# Altium project Battery BDC Hardware Split P2.PrjPcb
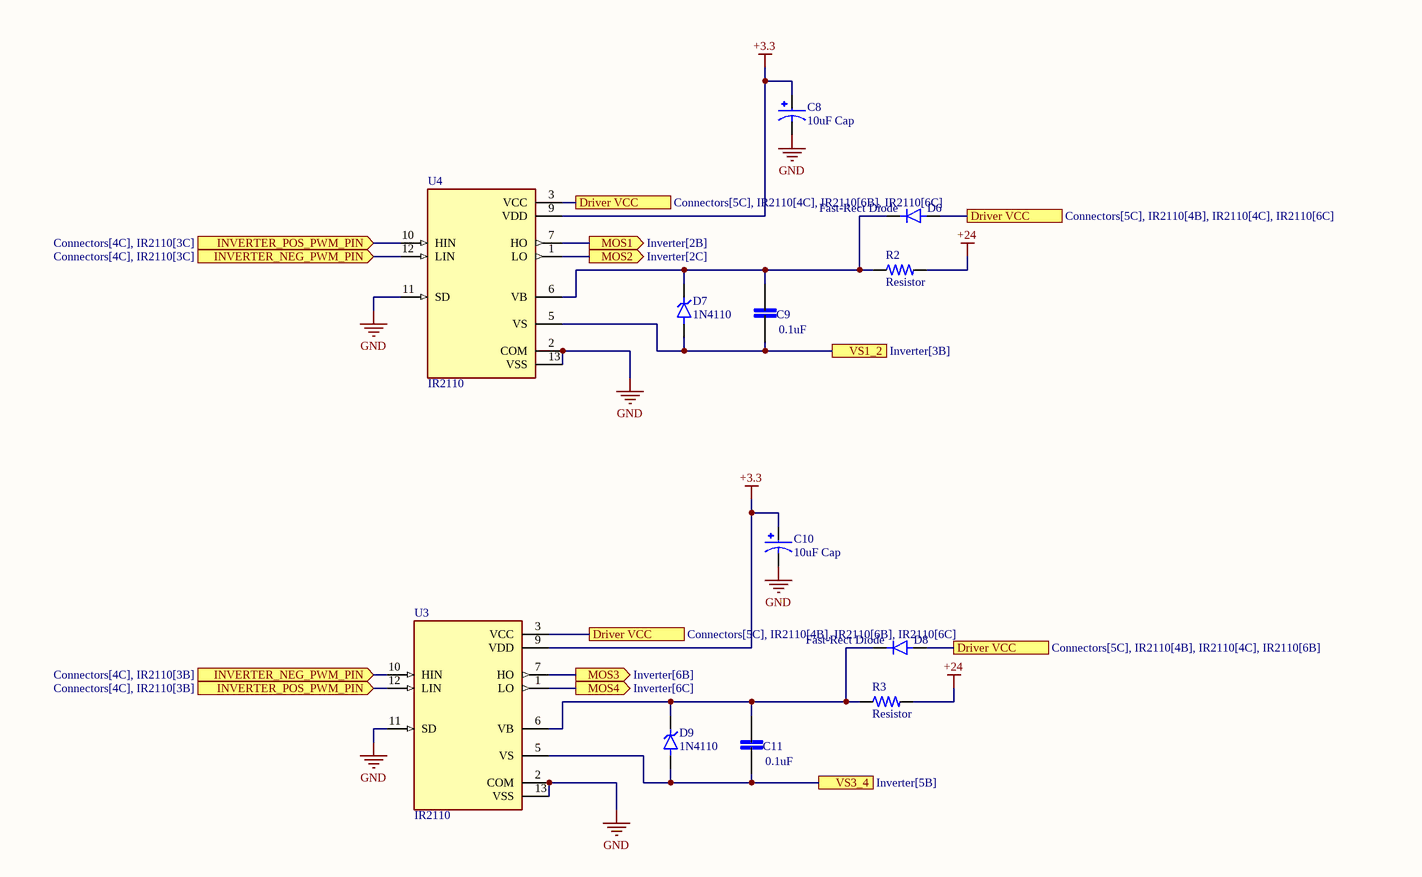
[diagram p0: IR2110.SchDoc]
4 sheets, 71 parts. Net scope: flat (ports and power ports of the same name join across sheets).
Board file: Inverter.PcbDoc
Sheets:
  IR2110.SchDoc
  Inverter.SchDoc
  Power Circuit.SchDoc
  Connectors.SchDoc

## Sheet IR2110.SchDoc
size A3; SheetNumber: 1; SheetTotal: 5

### Parts
C8  10uF Cap  [CAP_10uF]
C9  0.1uF  [Ceramic Capacitor]
C10  10uF Cap  [CAP_10uF]
C11  0.1uF  [Ceramic Capacitor]
D6  Fast-Rect Diode  [Common Trhough Hole]
D7  1N4110  [Common Trhough Hole]
D8  Fast-Rect Diode  [Common Trhough Hole]
D9  1N4110  [Common Trhough Hole]
R2  Resistor  [Resistor_Through Hole]
R3  Resistor  [Resistor_Through Hole]
U3  IR2110  [IR2110]
U4  IR2110  [IR2110]

### Ports
Driver VCC (see Connectors[5C], IR2110[4B], IR2110[4C], IR2110[6B]), Driver VCC (see Connectors[5C], IR2110[4B], IR2110[4C], IR2110[6C]), Driver VCC (see Connectors[5C], IR2110[4B], IR2110[6B], IR2110[6C]), Driver VCC (see Connectors[5C], IR2110[4C], IR2110[6B], IR2110[6C]), INVERTER_NEG_PWM_PIN (in, see Connectors[4C], IR2110[3B]), INVERTER_NEG_PWM_PIN (in, see Connectors[4C], IR2110[3C]), INVERTER_POS_PWM_PIN (in, see Connectors[4C], IR2110[3B]), INVERTER_POS_PWM_PIN (in, see Connectors[4C], IR2110[3C]), MOS1 (out, see Inverter[2B]), MOS2 (out, see Inverter[2C]), MOS3 (out, see Inverter[6B]), MOS4 (out, see Inverter[6C]), VS1_2 (see Inverter[3B]), VS3_4 (see Inverter[5B])

### Nets
+3.3: C8.P C10.P U3.9(VDD) U4.9(VDD)
+24: R2.2 R3.2
GND: C8.N C10.N U3.2(COM) U3.11(SD) U3.13(VSS) U4.2(COM) U4.11(SD) U4.13(VSS)
NetC9_1: C9.1 D7.2(A) U4.5(VS) ; port VS1_2
NetC9_2: C9.2 D6.1(K) D7.1(K) R2.1 U4.6(VB)
NetC11_1: C11.1 D9.2(A) U3.5(VS) ; port VS3_4
NetC11_2: C11.2 D8.1(K) D9.1(K) R3.1 U3.6(VB)
NetD6_2: D6.2(A) D8.2(A) U3.3(VCC) U4.3(VCC) ; port Driver VCC
NetD14_C: U4.7(HO) ; port MOS1
NetD15_C: U3.7(HO) ; port MOS3
NetD17_C: U4.1(LO) ; port MOS2
NetD18_C: U3.1(LO) ; port MOS4
NetJ4_1: U3.12(LIN) U4.10(HIN) ; port INVERTER_POS_PWM_PIN
NetJ4_3: U3.10(HIN) U4.12(LIN) ; port INVERTER_NEG_PWM_PIN

### Library data of the parts
C8 C10 = 10uF Cap: CAP ALUM 10UF 20% 50V RADIAL; MP: ECE-A1HN100UI; MF: Panasonic; SnapEDA_Link: https://www.snapeda.com/parts/ECE-A1HN100UI/Panasonic/view-part/2321690/?ref=snap; Price: None; Check_prices: https://www.snapeda.com/parts/ECE-A1HN100UI/Panasonic/view-part/2321690/?ref=eda; Value: *; Availability: In Stock; Package: RADIAL-2 Panasonic
C9 C11 = Ceramic Capacitor: MP: LD051A121KAB2A; MF: AVX; SnapEDA_Link: https://www.snapeda.com/parts/LD051A121KAB2A/AVX/view-part/?ref=snap; Package: 0805 AVX; Check_prices: https://www.snapeda.com/parts/LD051A121KAB2A/AVX/view-part/?ref=eda; Purchase-URL: https://pricing.snapeda.com/search/part/LD051A121KAB2A/?ref=eda; Price: None; Value: *; Availability: In Stock
D6 D8 = Normal Diode: MF: NTE Electronics, Inc.; MP: 1N4007; Package: DO-41 NTE Electronics; Check_prices: https://www.snapeda.com/parts/1N4007/NTE+Electronics/view-part/?ref=eda; Value: *; Purchase-URL: https://pricing.snapeda.com/search/part/1N4007/?ref=eda; Availability: In Stock; SnapEDA_Link: https://www.snapeda.com/parts/1N4007/NTE+Electronics/view-part/?ref=snap; Price: None
D7 D9 = Zener Diode: MP: 1SMA5926; MF: Taiwan Semiconductor; Package: SMA-2 Taiwan Semiconductor; Availability: In Stock; Purchase-URL: https://pricing.snapeda.com/search/part/1SMA5926/?ref=eda; SnapEDA_Link: https://www.snapeda.com/parts/1SMA5926/Taiwan+Semiconductor/view-part/?ref=snap; Price: None; Check_prices: https://www.snapeda.com/parts/1SMA5926/Taiwan+Semiconductor/view-part/?ref=eda; Value: *
R2 R3 = Resistor: Power_Rating: .25 W; MP: 2-2176053-0; Tolerance: 1%; Resistance: .33; MF: TE Connectivity; Price: None; Availability: In Stock; EU_RoHS_Compliance: Compliant with Exemptions; Package: 0805; Value: *; SnapEDA_Link: https://www.snapeda.com/parts/2-2176053-0/TE+Connectivity/view-part/?ref=snap; Check_prices: https://www.snapeda.com/parts/2-2176053-0/TE+Connectivity/view-part/?ref=eda
U3 U4 = IR2110: Half-Bridge Gate Driver IC Non-Inverting 16-SOIC; MF: Infineon; Package: SOIC-16 International Rectifier; Purchase-URL: https://pricing.snapeda.com/search/part/IR2110/?ref=eda; Value: *; SnapEDA_Link: https://www.snapeda.com/parts/IR2110/Infineon+Technologies/view-part/?ref=snap; Price: None; MP: IR2110; Check_prices: https://www.snapeda.com/parts/IR2110/Infineon+Technologies/view-part/?ref=eda; Availability: In Stock

## Sheet Inverter.SchDoc
size A2; SheetNumber: 2; SheetTotal: 5
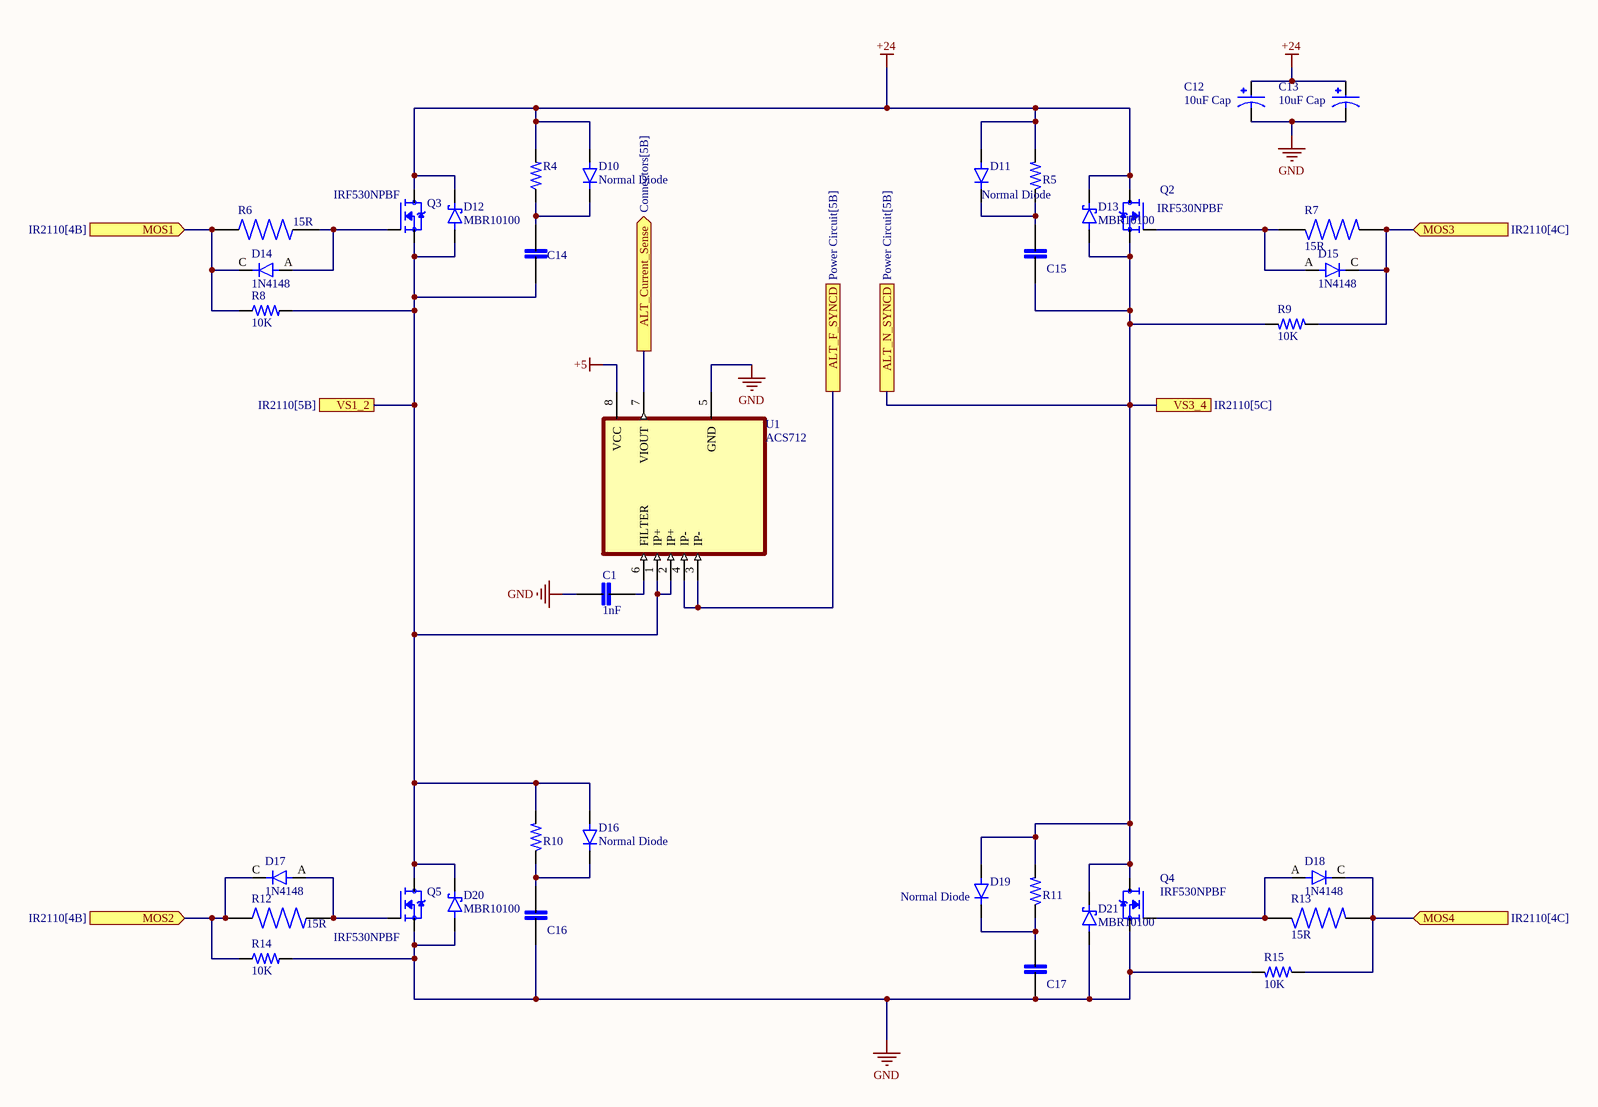
[diagram p1: Inverter.SchDoc]

### Parts
C1  1nF  [Ceramic Capacitor]
C12  10uF Cap  [2200uF_Cap]
C13  10uF Cap  [2200uF_Cap]
C14  Ceramic Capacitor  [Ceramic Capacitor]  (value not drawn)
C15  Ceramic Capacitor  [Ceramic Capacitor]  (value not drawn)
C16  Ceramic Capacitor  [Ceramic Capacitor]  (value not drawn)
C17  Ceramic Capacitor  [Ceramic Capacitor]  (value not drawn)
D10  Normal Diode  [Common Trhough Hole]
D11  Normal Diode  [Common Trhough Hole]
D12  MBR10100  [MBR10100]
D13  MBR10100  [MBR10100]
D14  1N4148  [1N4007 DIODE]
D15  1N4148  [1N4007 DIODE]
D16  Normal Diode  [Common Trhough Hole]
D17  1N4148  [1N4007 DIODE]
D18  1N4148  [1N4007 DIODE]
D19  Normal Diode  [Common Trhough Hole]
D20  MBR10100  [MBR10100]
D21  MBR10100  [MBR10100]
Q2  IRF530NPBF  [IRF530N]
Q3  IRF530NPBF  [IRF530N]
Q4  IRF530NPBF  [IRF530N]
Q5  IRF530NPBF  [IRF530N]
R4  Resistor  [Resistor_Through Hole]  (value not drawn)
R5  Resistor  [Resistor_Through Hole]  (value not drawn)
R6  15R  [Resistor_Through Hole]
R7  15R  [Resistor_Through Hole]
R8  10K  [Resistor_Through Hole]
R9  10K  [Resistor_Through Hole]
R10  Resistor  [Resistor_Through Hole]  (value not drawn)
R11  Resistor  [Resistor_Through Hole]  (value not drawn)
R12  15R  [Resistor_Through Hole]
R13  15R  [Resistor_Through Hole]
R14  10K  [Resistor_Through Hole]
R15  10K  [Resistor_Through Hole]
U1  ACS712  [ACS712]

### Ports
ALT_Current_Sense (out, see Connectors[5B]), ALT_F_SYNCD (see Power Circuit[5B]), ALT_N_SYNCD (see Power Circuit[5B]), MOS1 (in, see IR2110[4B]), MOS2 (in, see IR2110[4B]), MOS3 (in, see IR2110[4C]), MOS4 (in, see IR2110[4C]), VS1_2 (see IR2110[5B]), VS3_4 (see IR2110[5C])

### Nets
+5: U1.8(VCC)
+24: C12.P C13.P D10.2(A) D11.2(A) D12.1(K) D13.1(K) Q2.2(D) Q3.2(D) R4.2 R5.2
GND: C1.1 C12.N C13.N C16.1 C17.1 D20.3(A) D21.3(A) Q4.3(S) Q5.3(S) R14.2 R15.2 U1.5(GND)
NetC1_2: C1.2 U1.6(FILTER)
NetC9_1: C14.1 D12.3(A) D16.2(A) D20.1(K) Q3.3(S) Q5.2(D) R8.2 R10.2 U1.1(IP+) U1.2(IP+) ; port VS1_2
NetC11_1: C15.1 D13.3(A) D19.2(A) D21.1(K) Q2.3(S) Q4.2(D) R9.2 R11.2 ; port VS3_4, port ALT_N_SYNCD
NetC14_2: C14.2 D10.1(K) R4.1
NetC15_2: C15.2 D11.1(K) R5.1
NetC16_2: C16.2 D16.1(K) R10.1
NetC17_2: C17.2 D19.1(K) R11.1
NetD14_A: D14.A Q3.1(G) R6.2
NetD14_C: D14.C R6.1 R8.1 ; port MOS1
NetD15_A: D15.A Q2.1(G) R7.2
NetD15_C: D15.C R7.1 R9.1 ; port MOS3
NetD17_A: D17.A Q5.1(G) R12.2
NetD17_C: D17.C R12.1 R14.1 ; port MOS2
NetD18_A: D18.A Q4.1(G) R13.2
NetD18_C: D18.C R13.1 R15.1 ; port MOS4
NetJ1_3: U1.7(VIOUT) ; port ALT_Current_Sense
NetK2_11: U1.3(IP-) U1.4(IP-) ; port ALT_F_SYNCD

### Library data of the parts
C1 C14-C17 = Ceramic Capacitor: MP: LD051A121KAB2A; MF: AVX; SnapEDA_Link: https://www.snapeda.com/parts/LD051A121KAB2A/AVX/view-part/?ref=snap; Package: 0805 AVX; Check_prices: https://www.snapeda.com/parts/LD051A121KAB2A/AVX/view-part/?ref=eda; Purchase-URL: https://pricing.snapeda.com/search/part/LD051A121KAB2A/?ref=eda; Price: None; Value: *; Availability: In Stock
C12 C13 = 10uF Cap: as C8 on sheet IR2110; SnapEDA_Link: https://www.snapeda.com/parts/ECE-A1HN100UI/Panasonic/view-part/2321690/?ref=snap; Price: None; Check_prices: https://www.snapeda.com/parts/ECE-A1HN100UI/Panasonic/view-part/2321690/?ref=eda; Value: *; Availability: In Stock; Package: RADIAL-2 Panasonic
D10 D11 D16 D19 = Normal Diode: MF: NTE Electronics, Inc.; MP: 1N4007; Package: DO-41 NTE Electronics; Check_prices: https://www.snapeda.com/parts/1N4007/NTE+Electronics/view-part/?ref=eda; Value: *; Purchase-URL: https://pricing.snapeda.com/search/part/1N4007/?ref=eda; Availability: In Stock; SnapEDA_Link: https://www.snapeda.com/parts/1N4007/NTE+Electronics/view-part/?ref=snap; Price: None
D12 D13 D20 D21 = MBR10100: MF: Diodes Inc.; MP: 1N5817-T; Package: DO-41 Diodes Inc.; Price: None; Check_prices: https://www.snapeda.com/parts/1N5817-T/Diodes+Inc./view-part/?ref=eda; Value: *; SnapEDA_Link: https://www.snapeda.com/parts/1N5817-T/Diodes+Inc./view-part/?ref=snap; Availability: In Stock; Purchase-URL: https://pricing.snapeda.com/search/part/1N5817-T/?ref=eda
D14 D15 D17 D18 = 1N4007: Diode Standard 1000 V 1A Through Hole DO-41; MF: NTE Electronics, Inc.; Package: DO-41 NTE Electronics; Check_prices: https://www.snapeda.com/parts/1N4007/NTE+Electronics/view-part/?ref=eda; Value: *; Purchase-URL: https://pricing.snapeda.com/search/part/1N4007/?ref=eda; Availability: In Stock; SnapEDA_Link: https://www.snapeda.com/parts/1N4007/NTE+Electronics/view-part/?ref=snap; MP: 1N4007; Price: None
Q2-Q5 = IRF530NPBF: RoHS Compliant | Low RDS(on) | Industry-leading quality | Dynamic dv/dt Rating | Fast Switching | Fully Avalanche Rated | 175C Operating Temperature; MF: Infineon Technologies; Purchase-URL: https://pricing.snapeda.com/search/part/IRF530NPBF/?ref=eda; Check_prices: https://www.snapeda.com/parts/IRF530NPBF/Infineon+Technologies/view-part/?ref=eda; SnapEDA_Link: https://www.snapeda.com/parts/IRF530NPBF/Infineon+Technologies/view-part/?ref=snap; Price: None; Availability: In Stock; Package: TO-220 Infineon; MP: IRF530NPBF; Value: *
R4 R5 R8-R11 R14 R15 = Resistor: as R2 on sheet IR2110; Price: None; Availability: In Stock; EU_RoHS_Compliance: Compliant with Exemptions; Package: 0805; Value: *; SnapEDA_Link: https://www.snapeda.com/parts/2-2176053-0/TE+Connectivity/view-part/?ref=snap; Check_prices: https://www.snapeda.com/parts/2-2176053-0/TE+Connectivity/view-part/?ref=eda
R6 R7 R12 R13 = Resistor_Through Hole: 1.02 Ohms Â±1% 0.25W, 1/4W Through Hole Resistor Axial Metal Film; MP: MFR-25FTE52-1R; MF: Yageo; Availability: Warning; Value: *; Check_prices: https://www.snapeda.com/parts/MFR-25FTE52-1R/Yageo/view-part/4629919/?ref=eda; Package: Axial Yageo; Price: None; SnapEDA_Link: https://www.snapeda.com/parts/MFR-25FTE52-1R/Yageo/view-part/4629919/?ref=snap; Purchase-URL: https://pricing.snapeda.com/search/part/MFR-25FTE52-1R/?ref=eda
U1 = ACS712: Current Sensor 5A 1 Channel Hall Effect, Open Loop Bidirectional 8-SOIC (0.154, 3.90mm Width); MP: ACS712ELCTR-05B-T; MF: Allegro MicroSystems LLC; SnapEDA_Link: https://www.snapeda.com/parts/ACS712ELCTR-05B-T/Allegro+MicroSystems+LLC/view-part/?ref=snap; Package: SOIC-8 Allegro MicroSystems LLC; Check_prices: https://www.snapeda.com/parts/ACS712ELCTR-05B-T/Allegro+MicroSystems+LLC/view-part/?ref=eda; Purchase-URL: https://pricing.snapeda.com/search/part/ACS712ELCTR-05B-T/?ref=eda; Price: None; Value: *; Availability: In Stock

## Sheet Power Circuit.SchDoc
size A3; SheetNumber: 3; SheetTotal: 6
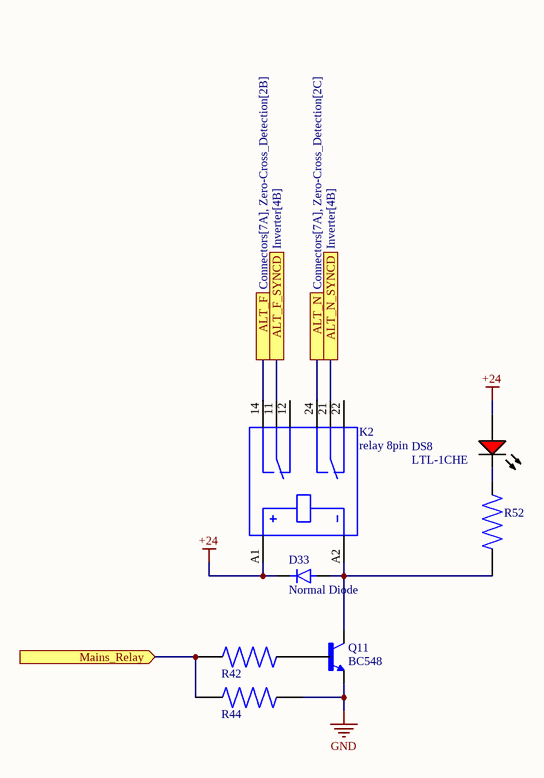
[diagram p2: Power Circuit.SchDoc]

### Parts
D33  Normal Diode  [Common Trhough Hole]
DS8  LTL-1CHE  [LED3mm]
K2  relay 8pin  [Relay socket 8pin]
Q11  BC548  [bc548]
R42  Resistor_Through Hole  [Resistor_Through Hole]  (value not drawn)
R44  Resistor_Through Hole  [Resistor_Through Hole]  (value not drawn)
R52  Resistor_Through Hole  [Resistor_Through Hole]  (value not drawn)

### Ports
ALT_F (see Connectors[7A], Zero-Cross_Detection[2B]), ALT_F_SYNCD (see Inverter[4B]), ALT_N (see Connectors[7A], Zero-Cross_Detection[2C]), ALT_N_SYNCD (see Inverter[4B]), Mains_Relay (in)

### Nets
+24: D33.1(K) DS8.1(A) K2.A1
GND: Q11.3(E) R44.1
NetC11_1: K2.21 ; port ALT_N_SYNCD
NetD33_2: D33.2(A) K2.A2 Q11.1(C) R52.2
NetDS8_2: DS8.2(K) R52.1
NetJ1_2: R42.2 R44.2 ; port Mains_Relay
NetJ3_1: K2.14 ; port ALT_F
NetJ3_3: K2.24 ; port ALT_N
NetK2_11: K2.11 ; port ALT_F_SYNCD
NetQ11_2: Q11.2(B) R42.1

Not connected (* = marked no-connect by the designer): K2 12(7) 22(2)

### Library data of the parts
D33 = Normal Diode: MF: NTE Electronics, Inc.; MP: 1N4007; Package: DO-41 NTE Electronics; Check_prices: https://www.snapeda.com/parts/1N4007/NTE+Electronics/view-part/?ref=eda; Value: *; Purchase-URL: https://pricing.snapeda.com/search/part/1N4007/?ref=eda; Availability: In Stock; SnapEDA_Link: https://www.snapeda.com/parts/1N4007/NTE+Electronics/view-part/?ref=snap; Price: None
DS8 = RED_LED 3mm: Radial LED, 12.6 mcd, 20 mA, 2 V, -55 to 100 degC, 2-Pin THD, RoHS, Bulk; Shielding: Unshielded; Resistance: 0.045 Ohm; Current Rating: 3.6 A; Tolerance: 20%; PackageReference: LTL-1CHE; PackageDescription: 2-Pin Through Hole Device, Dia 3.8 mm, Pitch 2.54 mm; Case\Package: Radial; Length: 0.97 inch; Width: 0.62 inch; Height: 1.1 inch; Radiation Hardening: No; Lead Pitch: 11.44 mm; ComponentLink1URL: http://www.us.liteon.com/; ComponentLink1Description: Manufacturer URL; RoHSCompliant: true; Packaging: Tray; Mount: Through Hole; Min Operating Temperature: -40 degC; Max Operating Temperature: 130 degC; ComponentLink2URL: https://datasheet.ciiva.com/15117/getdatasheetpartid-187746-15117985.pdf; Package Quantity: 55; ComponentLink2Description: Datasheet; DatasheetVersion: Dec-03
K2 = relay 8pin: General Purpose Relay DPDT _2 Form C_ 24VDC Coil Through Hole; MF: TE Connectivity; MP: 1-1393243-0; Package: None; Value: *; Availability: Unavailable; SnapEDA_Link: https://www.snapeda.com/parts/1-1393243-0/TE%20Connectivity%20Potter%20&%20Brumfield%20Relays/view-part/244556/?ref=snap; Price: None
Q11 = BC548: Bipolar (BJT) Transistor NPN 30V 100mA 300MHz 500mW Through Hole TO-92-3; MF: ON Semiconductor; DigiKey-Purchase-URL: https://snapeda.com/shop?store=DigiKey&id=2007035; MP: BC548; Availability: Warning; Package: TO-92 ON Semiconductor; Value: *; SnapEDA_Link: https://www.snapeda.com/parts/BC548/ON%20Semiconductor/view-part/2007035/?ref=snap; Price: None
R42 R44 R52 = Resistor_Through Hole: as R6 on sheet Inverter; Availability: Warning; Value: *; Check_prices: https://www.snapeda.com/parts/MFR-25FTE52-1R/Yageo/view-part/4629919/?ref=eda; Package: Axial Yageo; Price: None; SnapEDA_Link: https://www.snapeda.com/parts/MFR-25FTE52-1R/Yageo/view-part/4629919/?ref=snap; Purchase-URL: https://pricing.snapeda.com/search/part/MFR-25FTE52-1R/?ref=eda

## Sheet Connectors.SchDoc
size A3; SheetNumber: 5; SheetTotal: 5
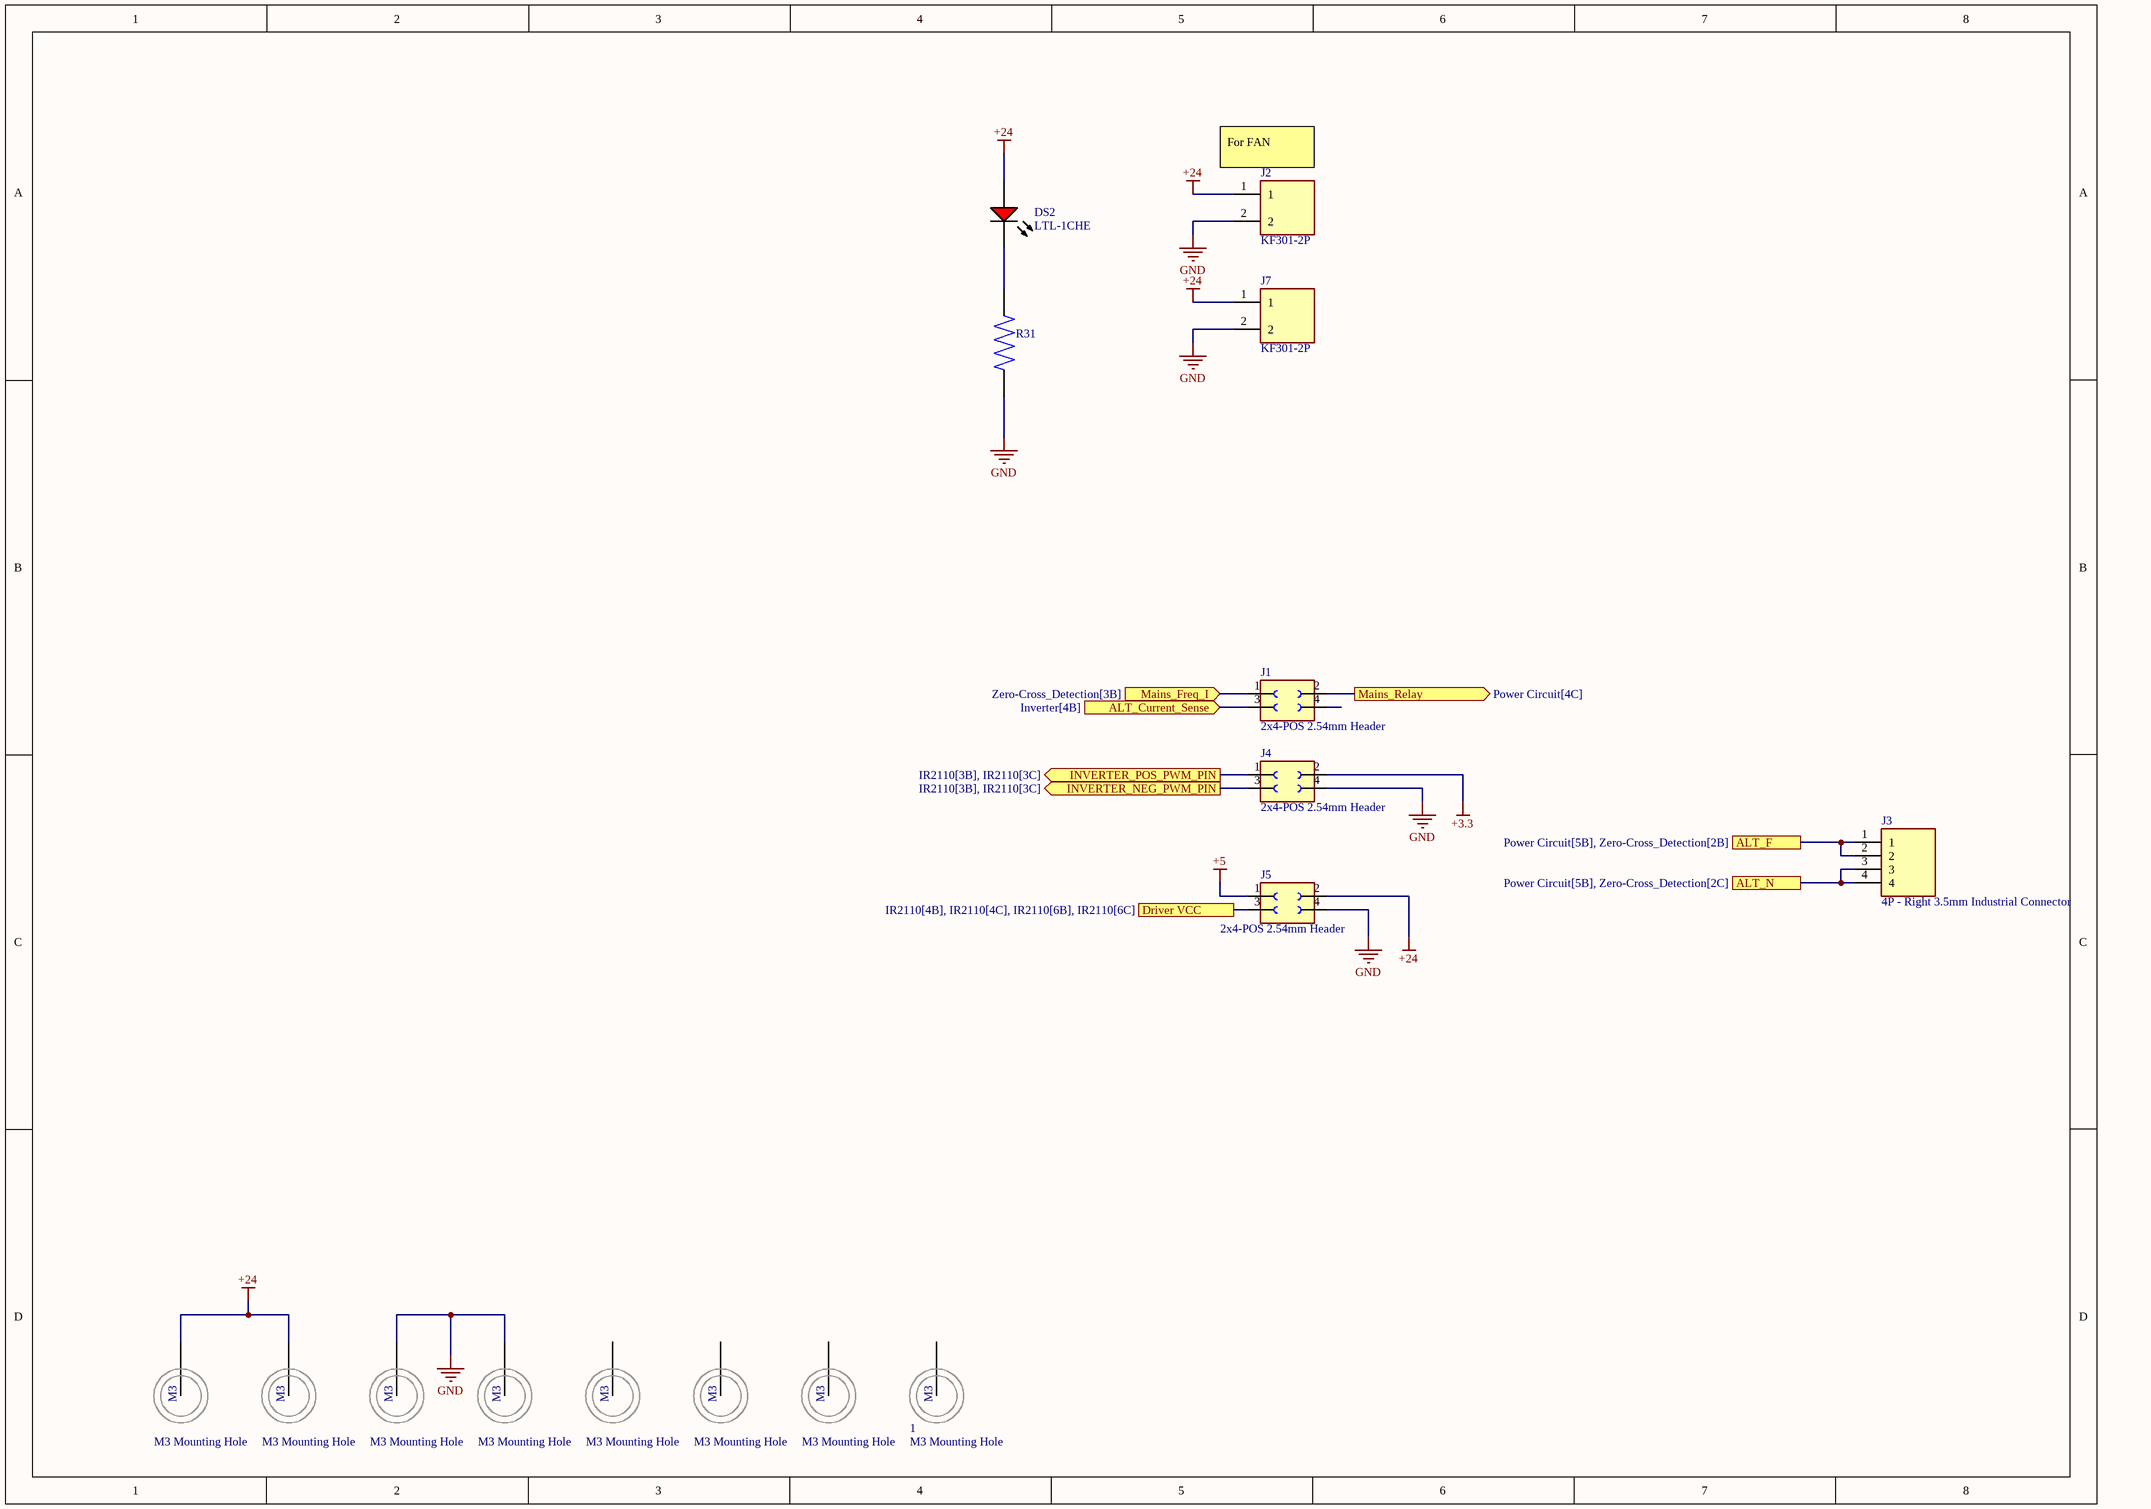
[diagram p3: Connectors.SchDoc]

### Parts
(Parts that share a designator on the sheet are numbered #1, #2 ... from top to bottom, then left to right.)
1  M3 Mounting Hole  [M3 - Mounting Hole]
#1  M3 Mounting Hole  [M3 - Mounting Hole]
#2  M3 Mounting Hole  [M3 - Mounting Hole]
#3  M3 Mounting Hole  [M3 - Mounting Hole]
#4  M3 Mounting Hole  [M3 - Mounting Hole]
#5  M3 Mounting Hole  [M3 - Mounting Hole]
#6  M3 Mounting Hole  [M3 - Mounting Hole]
#7  M3 Mounting Hole  [M3 - Mounting Hole]
DS2  LTL-1CHE  [LED3mm]
J1  2x4-POS 2.54mm Header  [2x4-POS 2.54mm Header]
J2  KF301-2P  [KF301-2P]
J3  4P - Right 3.5mm Industrial Connector  [4P - Right 3.5mm Industrial Connector]
J4  2x4-POS 2.54mm Header  [2x4-POS 2.54mm Header]
J5  2x4-POS 2.54mm Header  [2x4-POS 2.54mm Header]
J7  KF301-2P  [KF301-2P]
R31  Resistor_Through Hole  [Resistor_Through Hole]  (value not drawn)

### Ports
ALT_Current_Sense (in, see Inverter[4B]), ALT_F (see Power Circuit[5B], Zero-Cross_Detection[2B]), ALT_N (see Power Circuit[5B], Zero-Cross_Detection[2C]), Driver VCC (see IR2110[4B], IR2110[4C], IR2110[6B], IR2110[6C]), INVERTER_NEG_PWM_PIN (out, see IR2110[3B], IR2110[3C]), INVERTER_POS_PWM_PIN (out, see IR2110[3B], IR2110[3C]), Mains_Freq_I (in, see Zero-Cross_Detection[3B]), Mains_Relay (out, see Power Circuit[4C])

### Nets
+3.3: J4.2
+5: J5.1
+24: #1.1(M3) #2.1(M3) DS2.1(A) J2.1 J5.2 J7.1
GND: #3.1(M3) #4.1(M3) J2.2 J4.4 J5.4 J7.2 R31.2
NetD6_2: J5.3 ; port Driver VCC
NetDS2_2: DS2.2(K) R31.1
NetJ1_1: J1.1 ; port Mains_Freq_I
NetJ1_2: J1.2 ; port Mains_Relay
NetJ1_3: J1.3 ; port ALT_Current_Sense
NetJ3_1: J3.1 J3.2 ; port ALT_F
NetJ3_3: J3.3 J3.4 ; port ALT_N
NetJ4_1: J4.1 ; port INVERTER_POS_PWM_PIN
NetJ4_3: J4.3 ; port INVERTER_NEG_PWM_PIN

Not connected (* = marked no-connect by the designer): 1 1(M3); #5 1(M3); #6 1(M3); #7 1(M3); J1 4(3)

### Notes on the sheet
- (near J2) For FAN

### Library data of the parts
DS2 = RED_LED 3mm: as DS8 on sheet Power Circuit; PackageReference: LTL-1CHE; PackageDescription: 2-Pin Through Hole Device, Dia 3.8 mm, Pitch 2.54 mm; Case\Package: Radial; Length: 0.97 inch; Width: 0.62 inch; Height: 1.1 inch; Radiation Hardening: No; Lead Pitch: 11.44 mm; ComponentLink1URL: http://www.us.liteon.com/; ComponentLink1Description: Manufacturer URL; RoHSCompliant: true; Packaging: Tray; Mount: Through Hole; Min Operating Temperature: -40 degC; Max Operating Temperature: 130 degC; ComponentLink2URL: https://datasheet.ciiva.com/15117/getdatasheetpartid-187746-15117985.pdf; Package Quantity: 55; ComponentLink2Description: Datasheet; DatasheetVersion: Dec-03
J1 J4 J5 = 2x4-POS 2.54mm Header: Female header [WÃ¼rth Elektronik] 613004243121 Female header; SnapEDA_Link: https://www.snapeda.com/parts/613004243121/W%C3%BCrth%20Elektronik/view-part/1737074/?ref=snap; Check_prices: https://www.snapeda.com/parts/613004243121/W%C3%BCrth%20Elektronik/view-part/1737074/?ref=eda; Availability: Unavailable; Value: *; MF: WÃ¼rth Elektronik; Price: None; MP: 613004243121; Package: None
J2 J7 = KF301-2P: 2 Pin Terminal Block 5mm Pitch; Price: None; Value: *; MP: KF301-2P; Package: None; Availability: Unavailable
J3 = 4P - Right 3.5mm Industrial Connector: MP: 5-146290-4; Package: None; Price: None; Value: *; Availability: Unavailable
R31 = Resistor_Through Hole: as R6 on sheet Inverter; Availability: Warning; Value: *; Check_prices: https://www.snapeda.com/parts/MFR-25FTE52-1R/Yageo/view-part/4629919/?ref=eda; Package: Axial Yageo; Price: None; SnapEDA_Link: https://www.snapeda.com/parts/MFR-25FTE52-1R/Yageo/view-part/4629919/?ref=snap; Purchase-URL: https://pricing.snapeda.com/search/part/MFR-25FTE52-1R/?ref=eda

## Nets that join several sheets
+3.3: IR2110 (C8.P C10.P U3.9 U4.9), Connectors (J4.2)
+5: Inverter (U1.8), Connectors (J5.1)
+24: IR2110 (R2.2 R3.2), Inverter (10 pins), Power Circuit (D33.1 DS8.1 K2.A1), Connectors (6 pins)
GND: IR2110 (8 pins), Inverter (12 pins), Power Circuit (Q11.3 R44.1), Connectors (7 pins)
NetC9_1: IR2110 (C9.1 D7.2 U4.5), Inverter (10 pins)
NetC11_1: IR2110 (C11.1 D9.2 U3.5), Inverter (8 pins), Power Circuit (K2.21)
NetD6_2: IR2110 (D6.2 D8.2 U3.3 U4.3), Connectors (J5.3)
NetD14_C: IR2110 (U4.7), Inverter (D14.C R6.1 R8.1)
NetD15_C: IR2110 (U3.7), Inverter (D15.C R7.1 R9.1)
NetD17_C: IR2110 (U4.1), Inverter (D17.C R12.1 R14.1)
NetD18_C: IR2110 (U3.1), Inverter (D18.C R13.1 R15.1)
NetJ1_2: Power Circuit (R42.2 R44.2), Connectors (J1.2)
NetJ1_3: Inverter (U1.7), Connectors (J1.3)
NetJ3_1: Power Circuit (K2.14), Connectors (J3.1 J3.2)
NetJ3_3: Power Circuit (K2.24), Connectors (J3.3 J3.4)
NetJ4_1: IR2110 (U3.12 U4.10), Connectors (J4.1)
NetJ4_3: IR2110 (U3.10 U4.12), Connectors (J4.3)
NetK2_11: Inverter (U1.3 U1.4), Power Circuit (K2.11)